# EAGLE design waterLevelDisplay (EAGLE 7.6.0)

## Sheet 1 of 2
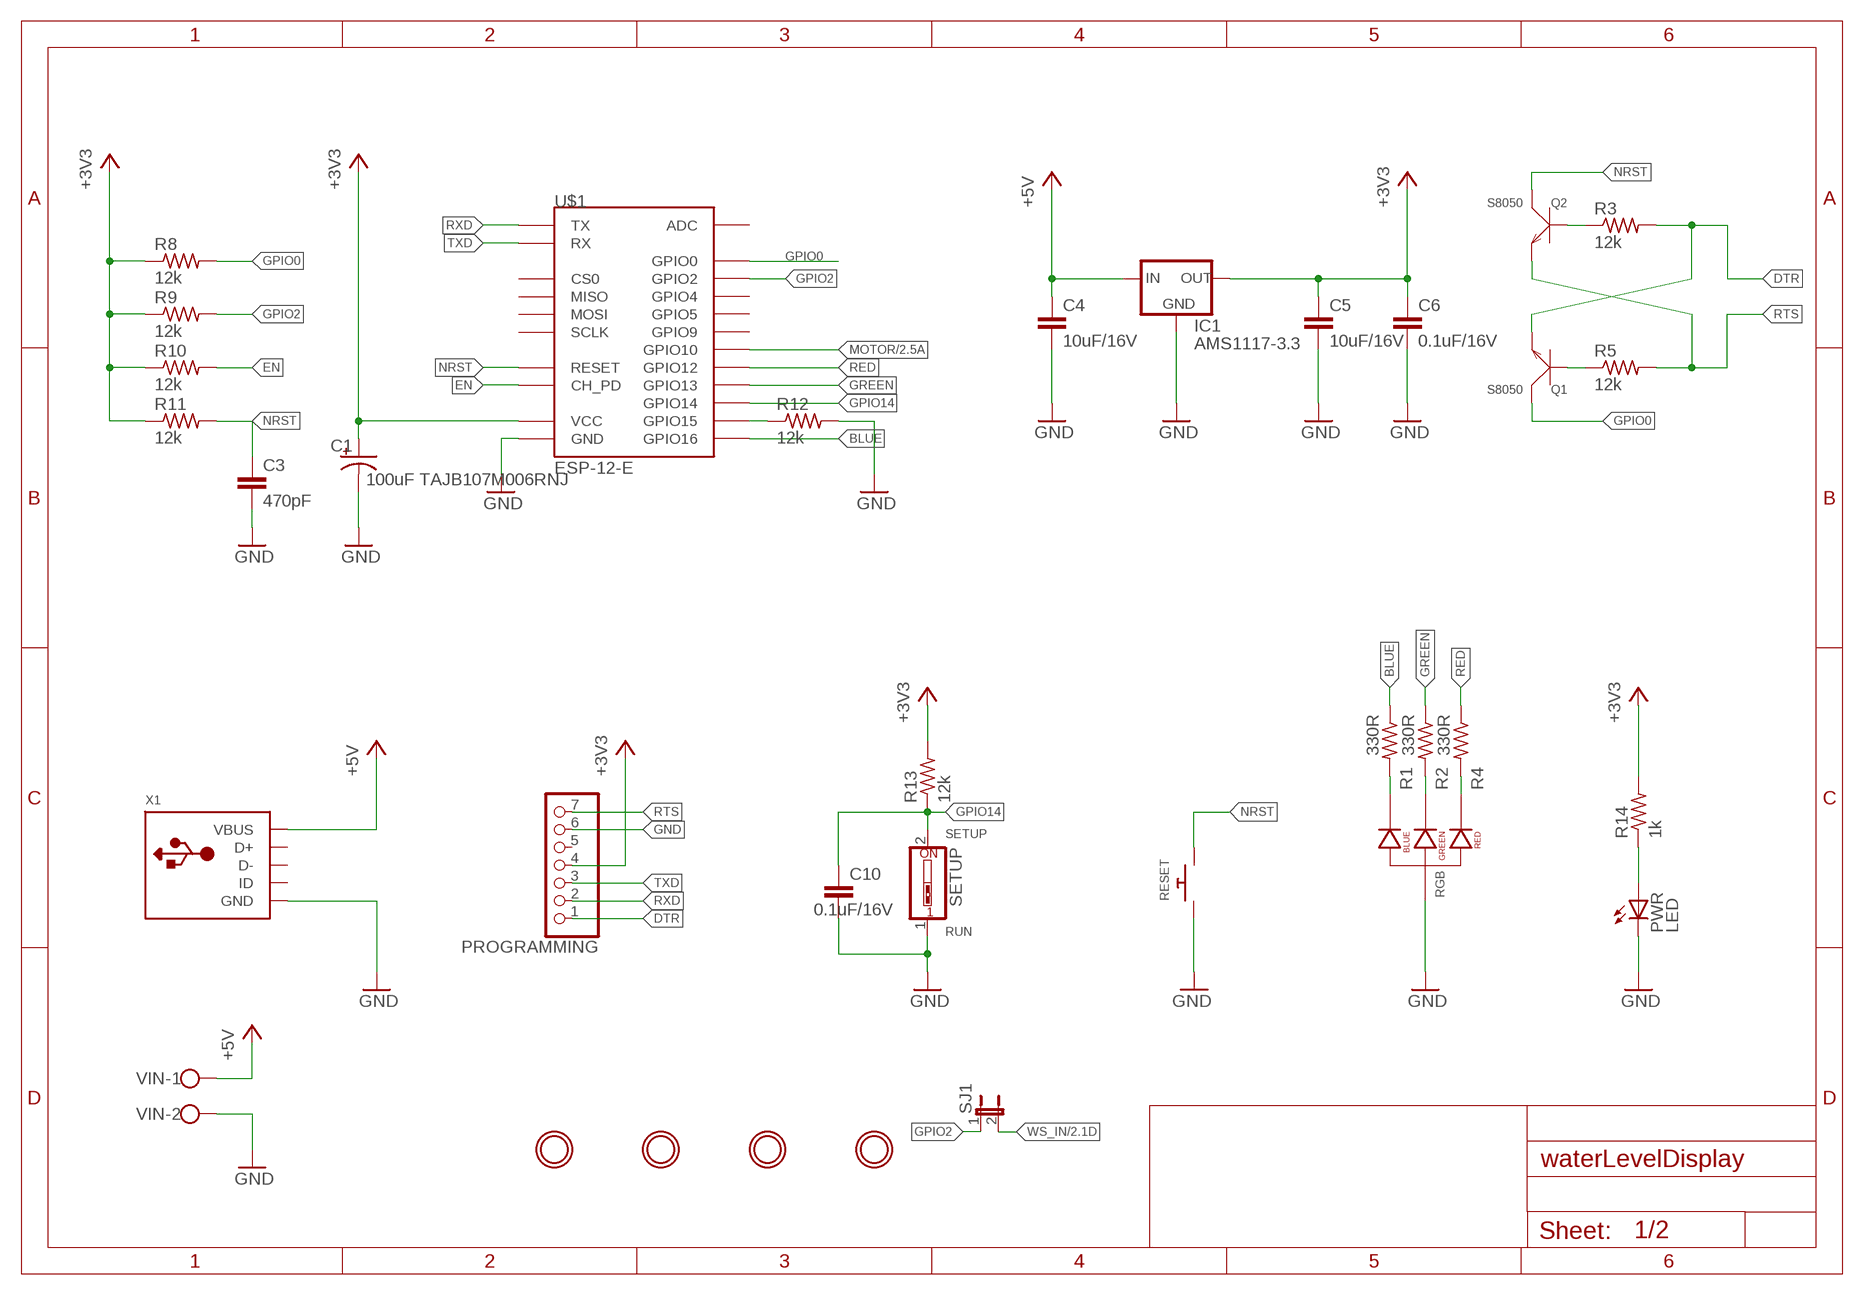
[diagram p0: schematic, sheet 1]

### Parts
C1  100uF TAJB107M006RNJ  CPOL-USA/3216-18R  [A/3216-18R]
C3  470pF  C-EUC0805K  [C0805K]
C4  10uF/16V  C-EUC0805K  [C0805K]
C5  10uF/16V  C-EUC0805K  [C0805K]
C6  0.1uF/16V  C-EUC0805K  [C0805K]
C10  0.1uF/16V  C-EUC0805K  [C0805K]
IC1  AMS1117-3.3  LM1117  [SOT223]
PROGRAMMING  PINHD-1X7  [1X07]
PWR  LED  LEDCHIP-LED0805  [CHIP-LED0805]
Q1  S8050  SMD-TRANSISTORS-NPN-25V-500MW(SOT-23)  [SOT-23]
Q2  S8050  SMD-TRANSISTORS-NPN-25V-500MW(SOT-23)  [SOT-23]
R1  330R  R-US_M0805  [M0805]
R2  330R  R-US_M0805  [M0805]
R3  12k  R-US_M0805  [M0805]
R4  330R  R-US_M0805  [M0805]
R5  12k  R-US_M0805  [M0805]
R8  12k  R-US_M0805  [M0805]
R9  12k  R-US_M0805  [M0805]
R10  12k  R-US_M0805  [M0805]
R11  12k  R-US_M0805  [M0805]
R12  12k  R-US_M0805  [M0805]
R13  12k  R-US_M0805  [M0805]
R14  1k  R-US_M0805  [M0805]
RESET  SWITCH_PUSHBUTTONEVQ-PE  [TACT_PANA-EVQ]
RGB  LED-RGB-CA-THRUCLEAR  [LED-RGB-THRU]
SETUP  SW_DIP-1  [EDG-01]
SJ1  SPARKFUN-PASSIVES_JUMPER-PTH-2-NC  [SPARKFUN-PASSIVES_PTH-JUMPER-NC_BOTTOM_NO_SILK]
U$1  ESP-12-E  [ESP-12-E]
U$3  MOUNTINGHOLE2.5  [MOUNTINGHOLE_2.5_PLATED]
U$4  MOUNTINGHOLE2.5  [MOUNTINGHOLE_2.5_PLATED]
U$5  MOUNTINGHOLE2.5  [MOUNTINGHOLE_2.5_PLATED]
U$6  MOUNTINGHOLE2.5  [MOUNTINGHOLE_2.5_PLATED]
VIN  W237-102  [W237-102]
X1  USB_MICRO_20329_V2  [4UCONN_20329_V2]

### Nets
+3V3: C1.+ C5.1 C6.1 IC1.2(OUT) PROGRAMMING.4 R8.1 R9.1 R10.1 R11.1 R13.2 R14.2 U$1.VCC ; also sheet 2
+5V: C4.1 IC1.3(IN) VIN.1 X1.VBUS ; also sheet 2
BLUE: R1.1 U$1.GPIO16
DTR: PROGRAMMING.1 Q1.2(E) R3.2
EN: R10.2 U$1.CH_PD
GND: C1.- C3.2 C4.2 C5.2 C6.2 C10.2 IC1.1(GND) PROGRAMMING.6 PWR.C R12.2 RESET.P$1 RGB.2(ANODE) SETUP.1 U$1.GND VIN.2 X1.BASE@1(GND) X1.BASE@2(GND) X1.GND X1.SPRT@1(GND) X1.SPRT@2(GND) X1.SPRT@3(GND) X1.SPRT@4(GND) ; also sheet 2
GPIO0: Q1.3(C) R8.2 U$1.GPIO0
GPIO2: R9.2 SJ1.1 U$1.GPIO2
GPIO14: C10.1 R13.1 SETUP.2 U$1.GPIO14
GREEN: R2.1 U$1.GPIO13
MOTOR: U$1.GPIO10 ; also sheet 2
N$1: Q2.1(B) R3.1
N$2: Q1.1(B) R5.1
N$3: R12.1 U$1.GPIO15
N$8: PWR.A R14.1
N$9: R4.2 RGB.1(RED_CATHODE)
N$10: R2.2 RGB.3(GREEN_CATHODE)
N$11: R1.2 RGB.4(BLUE_CATHODE)
NRST: C3.1 Q2.3(C) R11.2 RESET.P$2 U$1.RESET
RED: R4.1 U$1.GPIO12
RTS: PROGRAMMING.7 Q2.2(E) R5.2
RXD: PROGRAMMING.2 U$1.TX
TXD: PROGRAMMING.3 U$1.RX
WS_IN: SJ1.2 ; also sheet 2
Unconnected: PROGRAMMING.5 U$1.ADC U$1.CS0 U$1.GPIO4 U$1.GPIO5 U$1.GPIO9 U$1.MISO U$1.MOSI U$1.SCLK X1.D+ X1.D- X1.ID

### Notes on the sheet
- SETUP
- RUN

## Sheet 2 of 2
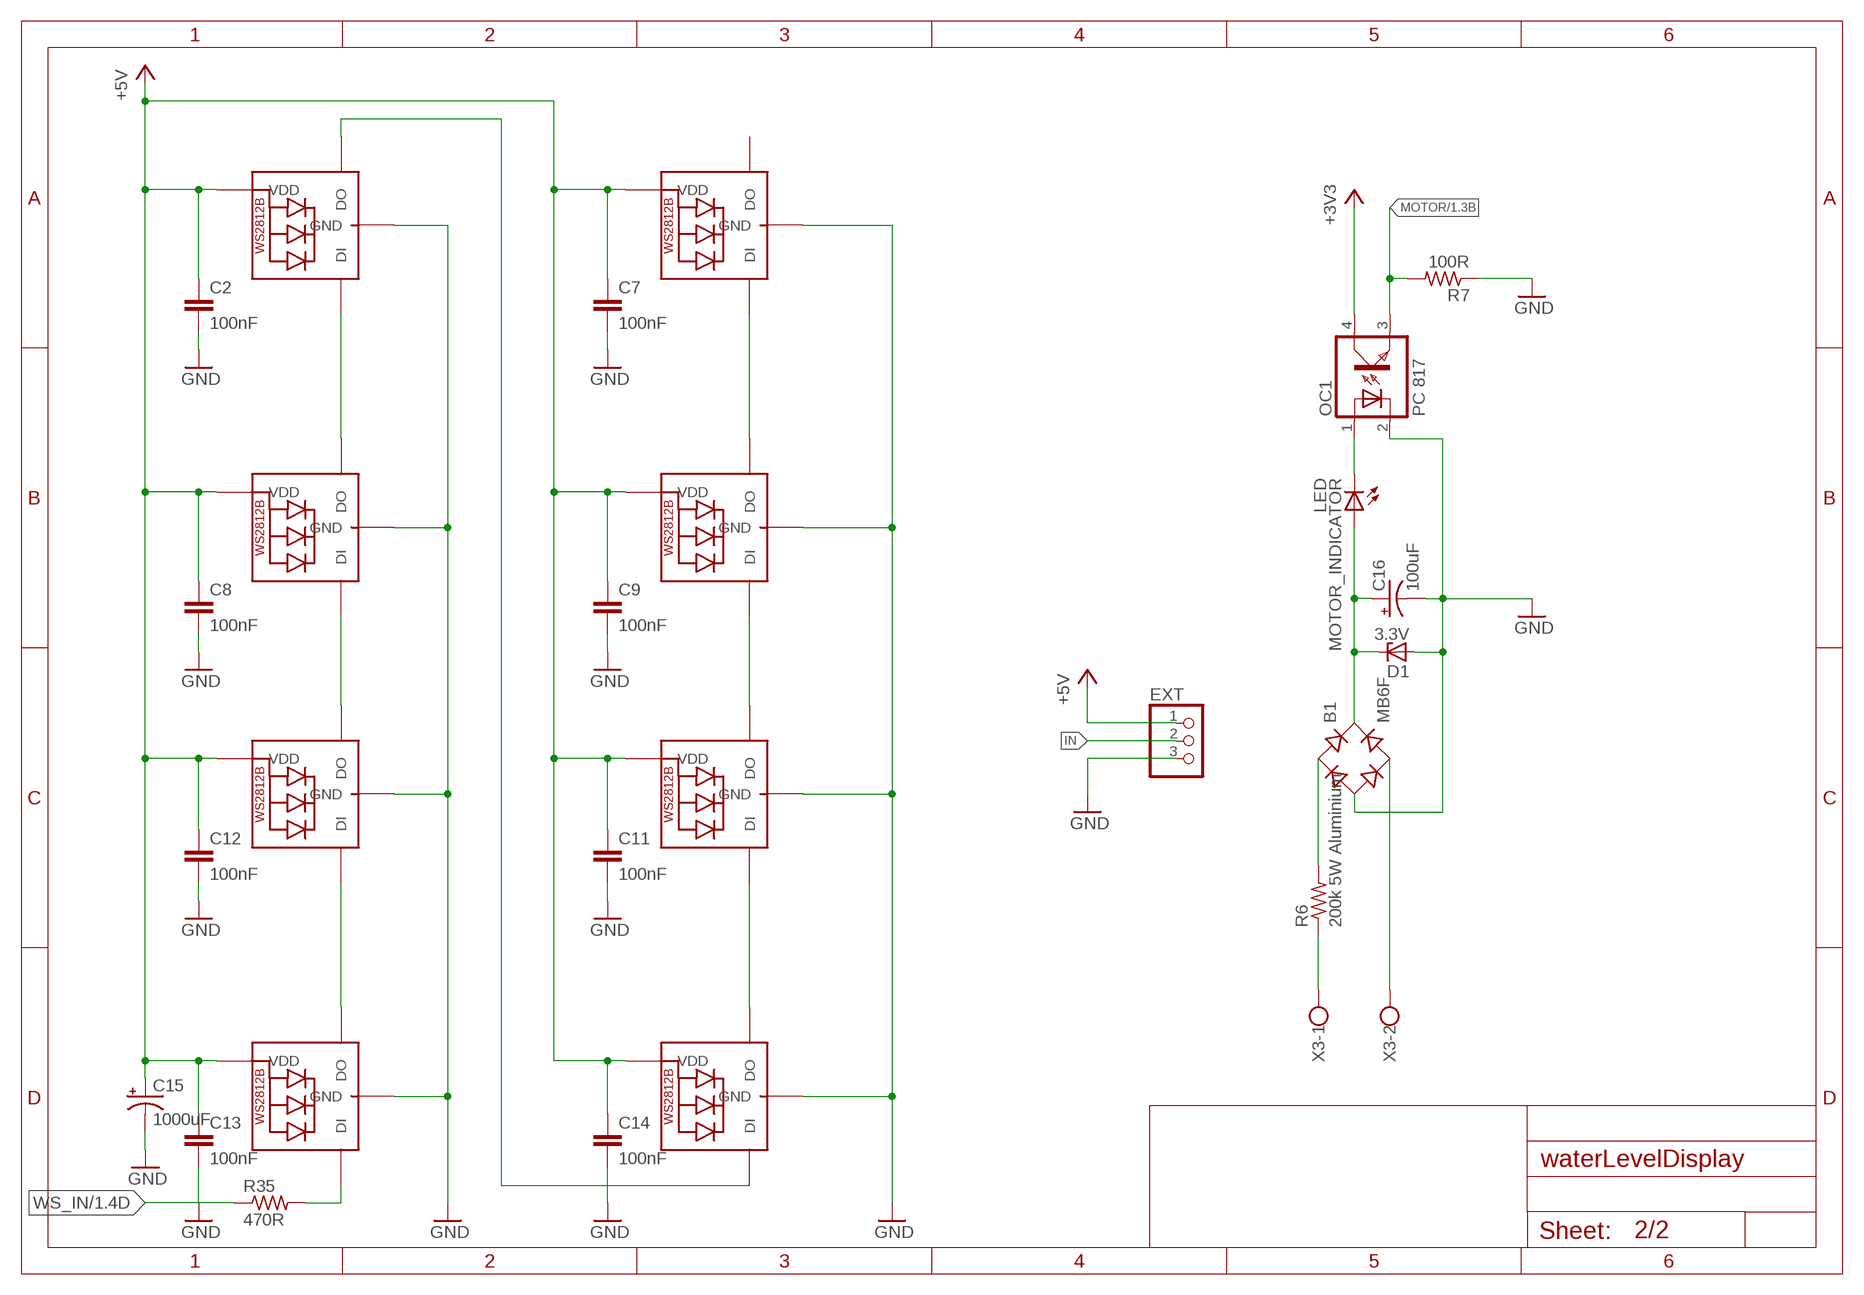
[diagram p1: schematic, sheet 2]

### Parts
B1  MB6F  MB6S  [SOIC-4]
C2  100nF  C-EUC0805K  [C0805K]
C7  100nF  C-EUC0805K  [C0805K]
C8  100nF  C-EUC0805K  [C0805K]
C9  100nF  C-EUC0805K  [C0805K]
C11  100nF  C-EUC0805K  [C0805K]
C12  100nF  C-EUC0805K  [C0805K]
C13  100nF  C-EUC0805K  [C0805K]
C14  100nF  C-EUC0805K  [C0805K]
C15  1000uF  CPOL-USE5-10.5  [E5-10,5]
C16  100uF  CPOL-USE2.5-7  [E2,5-7]
D1  3.3V  ZENER-DIODEZD-7.5  [ZDIO-7.5]
EXT  PINHD-1X3  [1X03]
LED1  WS2812B5050  [WS2812B]
LED2  WS2812B5050  [WS2812B]
LED3  WS2812B5050  [WS2812B]
LED4  WS2812B5050  [WS2812B]
LED5  WS2812B5050  [WS2812B]
LED6  WS2812B5050  [WS2812B]
LED7  WS2812B5050  [WS2812B]
LED8  WS2812B5050  [WS2812B]
MOTOR_INDICATOR  LED  LEDCHIP-LED0805  [CHIP-LED0805]
OC1  PC 817  SFH618A-3  [DIP4]
R6  200k 5W Aluminium  R-US_0617/22  [0617/22]
R7  100R  R-US_M0805  [M0805]
R35  470R  R-US_M0805  [M0805]
X3  W237-102  [W237-102]

### Nets
+3V3: OC1.4(COL) ; also sheet 1
+5V: C2.1 C7.1 C8.1 C9.1 C11.1 C12.1 C13.1 C14.1 C15.+ EXT.1 LED1.1-VDD(VDD) LED2.1-VDD(VDD) LED3.1-VDD(VDD) LED4.1-VDD(VDD) LED5.1-VDD(VDD) LED6.1-VDD(VDD) LED7.1-VDD(VDD) LED8.1-VDD(VDD) ; also sheet 1
GND: B1.- C2.2 C7.2 C8.2 C9.2 C11.2 C12.2 C13.2 C14.2 C15.- C16.- D1.A EXT.3 LED1.3-GND(GND) LED2.3-GND(GND) LED3.3-GND(GND) LED4.3-GND(GND) LED5.3-GND(GND) LED6.3-GND(GND) LED7.3-GND(GND) LED8.3-GND(GND) OC1.2(C) R7.1 ; also sheet 1
IN: EXT.2 LED8.4-DIN(DI) R35.2
MOTOR: OC1.3(EMIT) R7.2 ; also sheet 1
N$6: R6.1 X3.1
N$7: B1.~1(AC1) R6.2
N$12: B1.~2(AC2) X3.2
N$15: LED5.4-DIN(DI) LED8.2-DOUT(DO)
N$16: LED3.4-DIN(DI) LED5.2-DOUT(DO)
N$17: LED1.4-DIN(DI) LED3.2-DOUT(DO)
N$18: LED1.2-DOUT(DO) LED7.4-DIN(DI)
N$19: LED6.4-DIN(DI) LED7.2-DOUT(DO)
N$20: LED4.4-DIN(DI) LED6.2-DOUT(DO)
N$21: LED2.4-DIN(DI) LED4.2-DOUT(DO)
N$22: B1.+ C16.+ D1.C MOTOR_INDICATOR.A
N$23: MOTOR_INDICATOR.C OC1.1(A)
WS_IN: R35.1 ; also sheet 1
Unconnected: LED2.2-DOUT(DO)

## Library data of the parts
B1 = rectifier:MB*S: Bridge Rectifier Source: http://www.fairchildsemi.com/ds/MB/MB6S.pdf
C1 C15 C16 = rcl:CPOL-US: POLARIZED CAPACITOR, American symbol
C2-C14 = rcl:C-EU: CAPACITOR, European symbol
D1 = diode:ZENER-DIODE: Z-Diode
EXT = pinhead:PINHD-1X3: PIN HEADER
IC1 = v-reg-3:LM1117
LED1-LED8 = adafruit:WS2812B
MOTOR_INDICATOR PWR = led:LED: LED OSRAM: - CHIPLED LG R971, LG N971, LY N971, LG Q971, LY Q971, LO R971, LY R971 LH N974, LH R974 LS Q976, LO Q976, LY Q976 LO Q996 - Hyper CHIPLED LW Q18S LB Q993, LB Q99A, LB R99A - SideLED LS A670, LO A670, LY A670, LG A670, LP A670 LB A673, LV A673, LT A673, LW A673 LH A674 LY A675 LS A676, LA A676, LO A676, LY A676, LW A676 LS A679, LY A679, LG A679 - Hyper Micro SIDELED® LS Y876, LA Y876, LO Y876, LY Y876 LT Y87S - SmartLED LW L88C, LW L88S LB L89C, LB L89S, LG L890 LS L89K, LO L89K, LY L89K LS L896, LA L896, LO L896, LY L896 - TOPLED LS T670, LO T670, LY T670, LG T670, LP T670 LSG T670, LSP T670, LSY T670, LOP T670, LYG T670 LG T671, LOG T671, LSG T671 LB T673, LV T673, LT T673, LW T673 LH T674 LS T676, LA T676, LO T676, LY T676, LB T676, LH T676, LSB T676, LW T676 LB T67C, LV T67C, LT T67C, LS T67K, LO T67K, LY T67K, LW E67C LS E67B, LA E67B, LO E67B, LY E67B, LB E67C, LV E67C, LT E67C LW T67C LS T679, LY T679, LG T679 LS T770, LO T770, LY T770, LG T770, LP T770 LB T773, LV T773, LT T773, LW T773 LH T774 LS E675, LA E675, LY E675, LS T675 LS T776, LA T776, LO T776, LY T776, LB T776 LHGB T686 LT T68C, LB T68C - Hyper Mini TOPLED® LB M676 - Mini TOPLED Santana® LG M470 LS M47K, LO M47K, LY M47K Source: http://www.osram.convergy.de LUXEON: - LUMILED® LXK2-PW12-R00, LXK2-PW12-S00, LXK2-PW14-U00, LXK2-PW14-V00 LXK2-PM12-R00, LXK2-PM12-S00, LXK2-PM14-U00 LXK2-PE12-Q00, LXK2-PE12-R00, LXK2-PE12-S00, LXK2-PE14-T00, LXK2-PE14-U00 LXK2-PB12-K00, LXK2-PB12-L00, LXK2-PB12-M00, LXK2-PB14-N00, LXK2-PB14-P00, LXK2-PB14-Q00 LXK2-PR12-L00, LXK2-PR12-M00, LXK2-PR14-Q00, LXK2-PR14-R00 LXK2-PD12-Q00, LXK2-PD12-R00, LXK2-PD12-S00 LXK2-PH12-R00, LXK2-PH12-S00 LXK2-PL12-P00, LXK2-PL12-Q00, LXK2-PL12-R00 Source: www.luxeon.com KINGBRIGHT: KA-3528ASYC Source: www.kingbright.com
OC1 = optocoupler:SFH618?*: Optocoupler, Phototransistor Output, Low Input Current Source: Data sheet <http://www.vishay.com/docs/83673/sfh618.pdf>; MF: VISHAY/TELEFUNKEN; MPN: SFH618A-3; OC_FARNELL: 1020374; OC_NEWARK: 58K2209
PROGRAMMING = pinhead:PINHD-1X7: PIN HEADER
Q1 Q2 = s8050-transistor:SMD-TRANSISTORS-NPN-25V-500MW(SOT-23): 305010017; AVAILABILITY: Unavailable; DESCRIPTION: SMD Transistors NPN 25V-500mW%3B; MF: JCET; MP: S8050; PACKAGE: SOT-23-3 JCET; PRICE: None
R1-R14 R35 = rcl:R-US_: RESISTOR, American symbol
RESET = adafruit:SWITCH_PUSHBUTTON: Buttons SOFTTOUCHSMD_SJ - Soft touch temporary push button (Super Junk Akihabara) Compatible with SKPMANE010 [Mouser: 688-SKPMAN] C&K_KSS = Digikey: KSS221GLFS
RGB = SparkFun-LED:LED-RGB-CA-THRU: RGB Through-hole common anode SparkFun store front COM-10821 (diffuse) COM-10820 (clear); PROD_ID: DIO-10631
SETUP = special:SW_DIP-1: DIP SWITCH
SJ1 = ESP8266_Sparkfun:SPARKFUN-PASSIVES_JUMPER-PTH-2-NC
U$1 = esp8266modules:ESP-12-E: ESP8266 Wifi Module ESP-12-E; DIMENSIONS: 24.0 x 16.0 mm; PINS: 22; PITCH: 0.078" / 2 mm
U$3-U$6 = Adafruit SIM808 Breakout:MOUNTINGHOLE: Mounting Hole For #2 screws (0.086"/2.18mm width, 0.094"/2.4mm hole) use 2.5mm; BOM: EXCLUDE
VIN X3 = con-wago-500:W237-102: WAGO SCREW CLAMP; MPN: 237-102; OC_FARNELL: unknown; OC_NEWARK: 70K9898
X1 = Adafruit SIM808 Breakout:USB: USB Connectors USBMINIB - Surface Mount Female Mini-B USB Connector 4UConnector: 06564

## Net classes
0 default: width 0.203 mm, drill 0.356 mm, clearance 0.254 mm

## Board
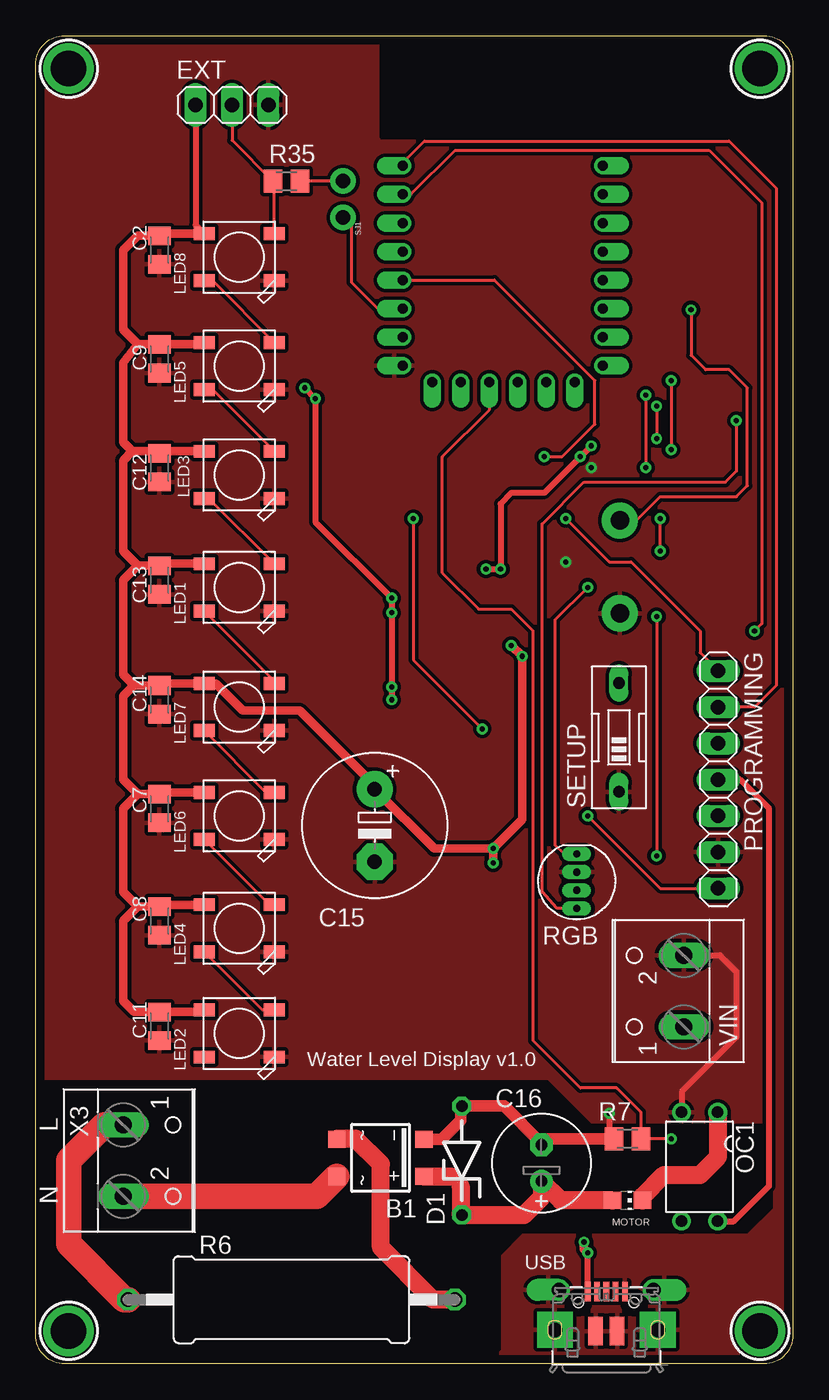
[diagram p2: board, top side]
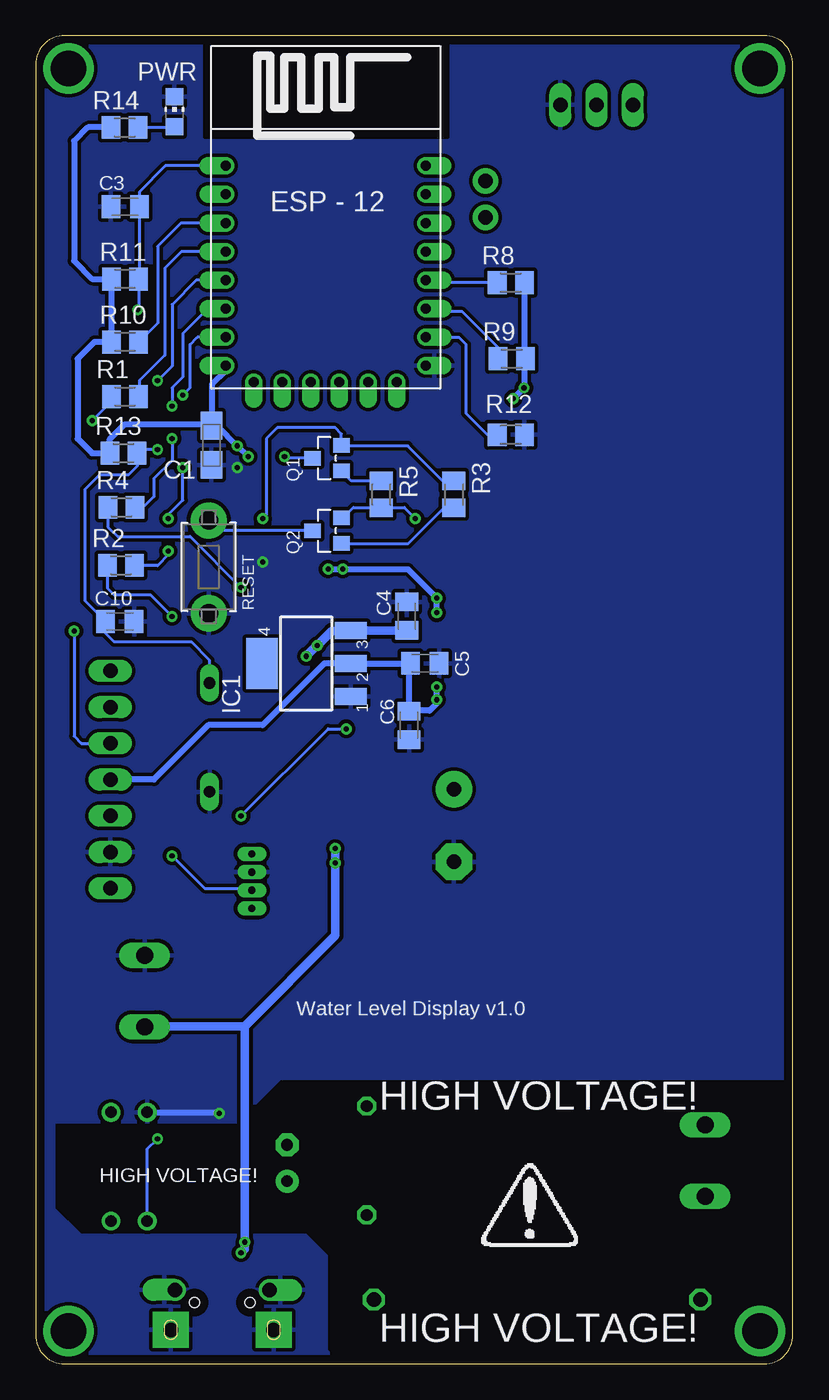
[diagram p3: board, bottom side, seen from below]

Size 53 x 93 mm. Coordinates in mm from the lower left corner, seen from the top.
Outline: 0,2 0,91 arc-90 2,93 51,93 arc-90 53,91 53,2 arc-90 51,0 2,0 arc-90 0,2
Copper layers (1*16): Top 0.035mm / dielectric 1.5mm / Bottom 0.035mm
Design rules "default *": minimum track width 8mil, minimum drill 14mil, track to track 8mil, track to pad 8mil, pad to pad 8mil, via to via 8mil, smd to smd 8mil, copper to edge 24mil, drill to drill 8mil, minimum pad ring 10mil, minimum via ring 8mil, stop-mask expansion 4mil, vias tented up to drill 0mil, thermal gap 10mil

### Footprints (pad centres in the part's own frame; a part is rotated, then mirrored left to right if it is on the bottom)
SOIC-4 = smd 1.2 x 1.2: + 1.3,3.05; - -1.3,3.05; ~1 -1.3,-3.05; ~2 1.3,-3.05
A/3216-18R = smd 1.95 x 1.5: + 1.375,0; - -1.375,0
C0805K = smd 1.3 x 1.6: 1 -1,0; 2 1,0
E5-10,5 = drill 1.016 pad 2.54: + -2.54,0 | drill 1.016 pad 2.54 octagon: - 2.54,0
E2,5-7 = drill 0.813 pad 1.6: + -1.27,0 | drill 0.813 pad 1.6 octagon: - 1.27,0
ZDIO-7.5 = drill 0.813 octagon: A 3.81,0; C -3.81,0
1X03 = drill 1.016 long: 1 -2.54,0; 2 0,0; 3 2.54,0
SOT223 = smd 1.219 x 2.235: 1 -2.311,-3.099; 2 0,-3.099; 3 2.311,-3.099 | smd 3.6 x 2.2: 4 0,3.099
WS2812B = smd 1.5 x 0.9: 1-VDD 2.45,-1.65; 2-DOUT 2.45,1.65; 3-GND -2.45,1.65; 4-DIN -2.45,-1.65
CHIP-LED0805 = smd 1.2 x 1.2: A 0,-1.05; C 0,1.05
DIP4 = drill 0.8: 1 -1.27,-3.81; 2 1.27,-3.81; 3 1.27,3.81; 4 -1.27,3.81
1X07 = drill 1.016 long: 1 -7.62,0; 2 -5.08,0; 3 -2.54,0; 4 0,0; 5 2.54,0; 6 5.08,0; 7 7.62,0
SOT-23 = smd 1.016 x 1.143: 1 -0.889,-1.016; 2 0.889,-1.016; 3 0,1.016
M0805 = smd 1.3 x 1.6: 1 -0.95,0; 2 0.95,0
0617/22 = drill 1.016 octagon: 1 -11.43,0; 2 11.43,0
TACT_PANA-EVQ = drill 1.3 pad 2.54: P$1 -3.25,0; P$2 3.25,0
LED-RGB-THRU = drill 0.508 pad 0.762 long: 1 1.905,0; 2 0.635,0; 3 -0.635,0; 4 -1.905,0
EDG-01 = drill 0.813 long: 1 0,-3.81; 2 0,3.81
SPARKFUN-PASSIVES_PTH-JUMPER-NC_BOTTOM_NO_SILK = drill 1.016 pad 1.778: 1 -1.27,0; 2 1.27,0
ESP-12-E = drill 0.7 offset: ADC -7.1,3.8; CH_PD -7.1,1.8; CS0 -5.14,-9.33; GND 6.9,-8.2; GPIO0 6.9,-2.2; GPIO2 6.9,-4.2; GPIO4 6.9,-0.2; GPIO5 6.9,1.8; GPIO9 -1.14,-9.33; GPIO10 0.86,-9.33; GPIO12 -7.1,-4.2; GPIO13 -7.1,-6.2; GPIO14 -7.1,-2.2; GPIO15 6.9,-6.2; GPIO16 -7.1,-0.2; MISO -3.14,-9.33; MOSI 2.86,-9.33; RESET -7.1,5.8; RX 6.9,3.8; SCLK 4.86,-9.33; TX 6.9,5.8; VCC -7.1,-8.2
MOUNTINGHOLE_2.5_PLATED = drill 2.5 pad 3.2: P$1 0,0
W237-102 = drill 1.194 long: 1 -2.5,-1.27; 2 2.5,-1.27
4UCONN_20329_V2 = smd 1 x 2: BASE@1 -0.75,-2; BASE@2 0.75,-2 | smd 0.4 x 1.35: D+ 0,0.775; D- -0.65,0.775; GND 1.3,0.775; ID 0.65,0.775; VBUS -1.3,0.775 | drill 1.016 pad 1.454 offset: SPRT@1 -3.3,0.9; SPRT@2 3.3,0.9 | drill 1.016 pad 2.5 square: SPRT@3 -3.6,-1.9; SPRT@4 3.6,-1.9 | hole 0.7: -1.95,0; 1.95,0

### Placement (x,y rotation side)
B1  24.13,14.43 270 top
C1  40.7,64.32 90 bottom
C2  8.66,77.99 270 top
C3  46.74,81.04 180 bottom
C4  27.03,52.36 90 bottom
C5  25.76,49.05 0 bottom
C6  26.87,44.7 270 bottom
C7  8.66,38.88 270 top
C8  8.66,31 270 top
C9  8.66,70.37 270 top
C10  47.11,51.99 0 bottom
C11  8.66,23.64 270 top
C12  8.66,62.75 270 top
C13  8.66,54.88 270 top
C14  8.66,46.5 270 top
C15  23.73,37.69 270 top
C16  35.4,14.06 90 top
D1  29.83,14.24 90 top
EXT  13.74,88.15 0 top
IC1  34.06,49.04 90 bottom
LED1  14.25,54.37 180 top
LED2  14.25,23.13 180 top
LED3  14.25,62.25 180 top
LED4  14.25,30.5 180 top
LED5  14.25,69.87 180 top
LED6  14.25,38.37 180 top
LED7  14.25,45.99 180 top
LED8  14.25,77.49 180 top
MOTOR_INDICATOR  41.43,11.45 270 top
OC1  46.47,13.8 180 top
PROGRAMMING  47.78,40.91 270 top
PWR  43.29,87.68 0 bottom
Q1  32.62,63.42 90 bottom
Q2  32.62,58.34 90 bottom
R1  46.74,67.74 180 bottom
R2  47.03,55.91 180 bottom
R3  23.73,60.88 90 bottom
R4  47,59.97 180 bottom
R5  28.81,60.88 270 bottom
R6  17.91,4.5 0 top
R7  41.43,15.76 0 top
R8  19.74,75.71 180 bottom
R9  19.68,70.38 180 bottom
R10  46.74,71.55 0 bottom
R11  46.74,75.96 0 bottom
R12  19.74,65.05 0 bottom
R13  46.85,63.77 180 bottom
R14  46.78,86.58 180 bottom
R35  17.55,82.82 180 top
RESET  40.89,55.8 90 bottom
RGB  37.87,33.8 90 top
SETUP  40.82,43.86 0 top
SJ1  21.52,81.55 90 top
U$1  32.6,78.09 0 bottom
U$3  50.7,2.3 0 top
U$4  50.7,90.7 0 top
U$5  2.3,90.7 0 top
U$6  2.3,2.3 0 top
VIN  44.11,26.1 90 top
X1  39.94,4.28 0 top
X3  7.41,14.23 270 top

### Tracks (layer width: path | path; a pad name or v marks a point on that pad's centre or on a via)
+3V3  (via drill 0.36 pad 0.76)
  Top 0.406: OC1.4 48.86,9.99 51.33,12.46 51.33,38.88 49.3,40.91 PROGRAMMING.4 | v24.92,46.5 v24.92,53.61 19.58,58.94 v19.58,67.58 v18.82,68.34 | v38.89,64.28 35.58,60.98 33.3,60.98 32.54,60.21 v32.54,55.64 v31.52,55.64
  Bottom 0.203: 18.79,70.44 R9.1 | R11.1 | 40.8,65.8 C1.+ 40.66,65.73 | 26.84,45.74 C6.1
  Bottom 0.406: R8.1 18.79,70.44 18.79,68.37 v19.58,67.58 | C6.1 26.87,48.66 | R14.2 49.35,86.58 50.32,85.61 50.32,77.23 49.05,75.96 R11.1 | R11.1 R10.1 48.89,71.55 50.06,70.37 50.06,64.79 49.05,63.77 R13.2 47.8,64.76 46.76,65.8 40.8,65.8 | U$1.VCC 39.7,69.56 40.66,68.6 40.66,65.73 | 26.84,45.74 25.42,45.74 24.92,46.24 v24.92,46.5 v24.92,47.39 | C1.+ 40.3,65.7 v38.89,64.28 v38.12,63.52 | PROGRAMMING.4 44.73,40.91 40.92,44.72 37.11,44.72 32.79,49.04 IC1.2 27.25,49.04 26.87,48.66 | v32.54,55.64 26.95,55.64 v24.92,53.61 v24.92,52.59 | 26.87,48.66 26.87,48.94 C5.1
+5V  (via drill 0.36 pad 0.76)
  Top 0.203: 11.66,24.64 LED2.1-VDD | LED4.1-VDD 8.8,32.15 C8.1 8.64,32.02 | 8.8,40.02 C7.1 | 8.8,47.64 C14.1 8.64,47.51 6.88,47.51 | 8.8,56.02 C13.1 | 8.8,79.14 C2.1 8.64,79.01 | C9.1 8.66,71.39 11.67,71.39 LED5.1-VDD 11.8,71.48 11.71,71.39 | LED3.1-VDD 8.8,63.9 C12.1 8.66,63.77 8.53,63.9 | 8.64,55.9 C13.1 | C13.1 7.12,55.88 | 8.64,39.89 C7.1 | C7.1 7.12,39.88 | 8.53,32.15 8.41,32.02 | 8.64,24.65 C11.1 | 45.34,23.64 VIN.1 | 38.64,7.75 v38.63,7.76
  Top 0.406: X1.VBUS 38.64,7.75 | EXT.1 11.2,79.73 LED8.1-VDD
  Top 0.61: C11.1 11.66,24.64 | LED6.1-VDD 8.8,40.02 | 8.8,47.64 LED7.1-VDD 12.6,47.64 14.5,45.74 18.48,45.74 23.73,40.49 C15.+ 27.88,36.08 v32.03,36.08 | LED1.1-VDD 8.8,56.02 | LED8.1-VDD 8.8,79.14 | 11.71,71.39 7.14,71.39 | 7.14,71.39 6.12,72.41 6.12,77.99 7.14,79.01 8.64,79.01 | LED3.1-VDD 6.76,63.9 6.12,64.53 6.12,70.12 7.14,71.39 | 8.53,63.9 6.75,63.9 6.12,63.26 6.12,56.91 7.14,55.9 8.64,55.9 | 7.12,55.88 6.12,54.88 6.12,48.28 6.88,47.51 | C14.1 6.87,47.5 6.12,46.75 6.12,40.91 7.14,39.89 8.64,39.89 | 7.12,39.88 6.12,38.88 6.12,33.04 7.14,32.02 | 8.64,32.02 8.41,32.02 7.14,32.02 | LED4.1-VDD 8.53,32.15 | 7.14,32.02 6.12,31 6.12,25.42 6.88,24.65 8.64,24.65 | v32.03,36.08 34.06,38.12 v34.06,49.55 v33.3,50.31 | v32.03,35.07 v32.03,36.08 | v38.38,8.52 38.38,8.02 v38.63,7.76
  Bottom 0.203: 30.99,51.32 IC1.3 | C4.1 | 45.34,23.64 VIN.1
  Bottom 0.61: 30.99,51.32 32.28,51.32 v34.06,49.55 | IC1.3 C4.1 | v32.03,36.08 32.03,29.99 38.38,23.64 | 38.38,23.64 45.34,23.64 | 38.38,23.64 38.38,8.02 v38.63,7.76
BLUE
  Bottom 0.203: U$1.GPIO16 42.8,77.89 43.97,76.72 43.97,70.63 45.74,68.85 45.74,67.79 R1.1
DTR  (via drill 0.36 pad 0.76)
  Top 0.203: v37.11,59.2 40.16,56.15 41.68,56.15 46.51,51.32 46.51,49.8 PROGRAMMING.1
  Bottom 0.203: R3.2 24.5,61.83 26.95,64.28 31.57,64.28 Q1.2 31.6,65.12 32.03,65.55 36.09,65.55 36.85,64.79 36.85,59.45 v37.11,59.2
EN
  Bottom 0.203: U$1.CH_PD 42.84,79.89 44.47,78.25 44.47,72.87 R10.2
GND  (via drill 0.36 pad 0.76)
  Top 0.203: 29.74,17.96 D1.A | 35.4,15.43 C16.- 35.84,15.76
  Top 0.406: VIN.2 47.9,28.6 49.05,27.45 49.05,22.88 45.24,19.07 45.24,17.65 OC1.2 | v40.16,17.54 40.16,16.08 R7.1
  Top 0.813: B1.- 28.43,15.73 29.74,17.03 29.74,17.96 | D1.A 32.79,18.05 35.4,15.43 | R7.1 35.84,15.76
  Bottom 0.406: OC1.2 40.23,17.61 v40.16,17.54
  other vias: 38.89,62.75 37.11,56.15
  pour Top: -0.74,93.49 -0.74,-0.49 53.87,-0.49 53.87,93.49
  pour Bottom: -0.74,93.49 53.87,93.49 53.87,-0.49 -0.74,-0.49
GPIO0  (via drill 0.36 pad 0.76)
  Top 0.203: v35.58,63.52 36.85,63.52 39.14,65.8 39.14,68.85 32.1,75.89 U$1.GPIO0
  Bottom 0.203: R8.2 25.52,75.71 U$1.GPIO0 | Q1.3 35.49,63.42 v35.58,63.52
GPIO2
  Top 0.203: U$1.GPIO2 25.66,73.93 23.9,73.93 22.12,75.71 22.12,79.68 SJ1.1
  Bottom 0.203: R9.2 20.63,71.16 23.14,73.68 25.49,73.68 U$1.GPIO2
GPIO14  (via drill 0.36 pad 0.76)
  Top 0.203: v44.47,68.85 v44.47,64.02
  Bottom 0.203: U$1.GPIO14 41.76,75.89 43.46,74.18 43.46,69.87 v44.47,68.85 | v44.47,64.02 45.65,64.02 R13.1 45.9,62.85 46.51,62.25 48.54,62.25 49.55,61.23 49.55,53.43 C10.1 48.11,51.15 47.52,50.56 42.13,50.56 40.82,49.26 SETUP.2
GREEN  (via drill 0.36 pad 0.76)
  Top 0.203: v42.7,67.83 v42.7,62.75 | v43.71,56.91 v43.71,59.2
  Bottom 0.203: U$1.GPIO13 41.68,71.89 42.19,71.38 42.19,68.34 v42.7,67.83 | v43.71,56.91 43.71,56.66 44.47,55.9 46.06,55.9 R2.1 | v43.71,59.2 43.71,59.45 42.7,60.47 v42.7,62.75
IN
  Top 0.203: LED8.4-DIN 16.7,82.72 R35.2 13.74,85.68 EXT.2
MOTOR  (via drill 0.36 pad 0.76)
  Top 0.203: v44.47,15.76 R7.2 42.38,17.61 40.66,19.32 38.12,19.32 34.82,22.62 34.82,51.32 33.3,52.85 31.01,52.85 28.47,55.39 28.47,63.52 31.77,66.82 31.77,68.72 U$1.GPIO10
  Bottom 0.203: OC1.3 45.2,15.04 v44.47,15.76
N$1
  Bottom 0.203: R3.1 24.44,59.93 26.95,57.42 31.57,57.42 Q2.1
N$2
  Bottom 0.203: R5.1 30.9,61.83 Q1.1
N$3
  Bottom 0.203: U$1.GPIO15 23.38,71.89 22.88,71.39 22.88,66.56 21.36,65.04 20.71,65.04 R12.1
N$4
  cutout Top: 41.17,92.47 24.15,92.47 24.15,85.87 41.17,85.87
N$5
  cutout Bottom: 41.17,92.47 24.15,92.47 24.15,85.87 41.17,85.87
N$6
  Top 1.778: X3.1 4.8,16.73 2.31,14.24 2.31,8.4 6.21,4.5 R6.1
N$7
  Top 0.203: 21.12,15.76 B1.~1
  Top 1.27: R6.2 27.8,4.5 24.15,8.14 24.15,13.99 22.38,15.76 21.12,15.76
N$8
  Bottom 0.203: R14.1 43.34,86.58 PWR.A
N$9  (via drill 0.36 pad 0.76)
  Top 0.203: RGB.1 36.98,35.7 36.35,36.34 36.35,52.09 v38.63,54.37
  Bottom 0.203: R4.2 47.95,58.61 47.27,57.93 42.19,57.93 v38.63,54.37
N$10  (via drill 0.36 pad 0.76)
  Top 0.203: v43.46,52.34 v43.46,35.58
  Bottom 0.203: R2.2 47.98,54.32 47.52,53.86 44.98,53.86 v43.46,52.34 | RGB.3 38,33.29 41.17,33.29 v43.46,35.58
N$11  (via drill 0.36 pad 0.76)
  Top 0.203: RGB.4 36.47,31.89 35.46,33.04 35.46,58.82 38.38,61.74 48.28,61.74 49.05,62.5 v49.05,66.06
  Bottom 0.203: R1.2 47.69,67.41 v49.05,66.06
N$12
  Top 0.203: 21.11,13.1 B1.~2
  Top 1.778: X3.2 19.69,11.73 B1.~2
N$13
  cutout Top: 51.59,16.78 38.89,16.78 35.84,19.83 0.53,19.83 0.53,3.06 3.07,0.52 32.03,0.52 32.54,1.03 32.54,7.64 34.06,9.16 49.81,9.16 51.59,10.94
N$14
  cutout Bottom: 0.53,19.83 35.84,19.83 38.89,16.78 51.59,16.78 51.59,10.94 49.81,9.16 34.06,9.16 32.54,7.64 32.54,1.03 32.03,0.52 3.07,0.52 0.53,3.06
N$15
  Top 0.203: LED8.2-DOUT 12.38,75.84 LED5.4-DIN
N$16
  Top 0.203: LED5.2-DOUT 12.38,68.22 LED3.4-DIN
N$17
  Top 0.203: LED3.2-DOUT 12.12,60.6 LED1.4-DIN
N$18
  Top 0.203: LED7.4-DIN 16.7,47.82 LED1.2-DOUT
N$19
  Top 0.203: LED6.4-DIN 16.12,40.02 LED7.2-DOUT
N$20
  Top 0.203: LED4.4-DIN 16.37,32.15 LED6.2-DOUT
N$21
  Top 0.203: LED2.4-DIN 15.86,24.78 LED4.2-DOUT
N$22
  Top 0.203: 29.08,13.13 29.74,12.46 | 29.74,10.51 D1.C | 35.46,12.73 C16.+
  Top 1.27: B1.+ 29.08,13.13 | 29.74,12.46 29.74,10.51 | D1.C 34.18,10.43 35.46,11.7 35.46,12.73 | MOTOR_INDICATOR.A 36.75,11.45 C16.+
N$23
  Top 0.203: 47.78,17.57 OC1.1
  Top 1.27: 47.78,17.57 47.78,14.49 46.51,13.22 43.97,13.22 42.48,11.73 MOTOR_INDICATOR.C
NRST  (via drill 0.36 pad 0.76)
  Top 0.203: v45.87,73.8 45.87,70.63 46.89,69.61 48.54,69.61 49.81,68.34 49.81,61.48 49.05,60.72 43.71,60.72 42.04,59.05 RESET.P$2
  Bottom 0.203: U$1.RESET 43.92,83.89 45.74,82.06 C3.1 45.74,76.01 R11.2 45.79,73.88 v45.87,73.8 | Q2.3 40.17,58.34 RESET.P$2
RED  (via drill 0.36 pad 0.76)
  Top 0.203: v43.46,67.07 v43.46,64.79
  Bottom 0.203: U$1.GPIO12 40.96,73.89 42.7,72.15 42.7,69.1 43.46,68.34 v43.46,67.07 | R4.1 46.03,59.96 45.49,59.96 44.73,60.72 44.73,61.99 43.46,63.26 v43.46,64.79
RTS  (via drill 0.36 pad 0.76)
  Top 0.203: v26.44,59.2 26.44,49.29 v31.27,44.47 | PROGRAMMING.7 43.71,33.29 v38.63,38.37
  Bottom 0.203: 28.84,59.96 30.76,59.96 31.49,59.23 Q2.2 | 28.84,59.96 R5.2 | v38.63,38.37 32.54,44.47 v31.27,44.47 | 28.84,59.96 27.2,59.96 v26.44,59.2
RXD
  Top 0.203: U$1.TX 25.7,84.11 27.2,85.61 48.54,85.61 51.84,82.31 51.84,47.51 50.32,45.99 PROGRAMMING.2
TXD  (via drill 0.36 pad 0.76)
  Top 0.203: U$1.RX 26.27,81.89 29.36,84.98 47.14,84.98 50.82,81.3 50.82,51.83 v50.32,51.32
  Bottom 0.203: v50.32,51.32 50.32,43.96 49.81,43.45 PROGRAMMING.3
WS_IN
  Top 0.203: SJ1.2 R35.1 | R35.1

### Text on the board
tPlace: Water Level Display v1.0
bPlace: Water Level Display v1.0
tNames: L | N | MOTOR | USB
bNames: HIGH VOLTAGE! | HIGH VOLTAGE! | HIGH VOLTAGE!